# Altium schematic sheet FETs.SchDoc
size A4
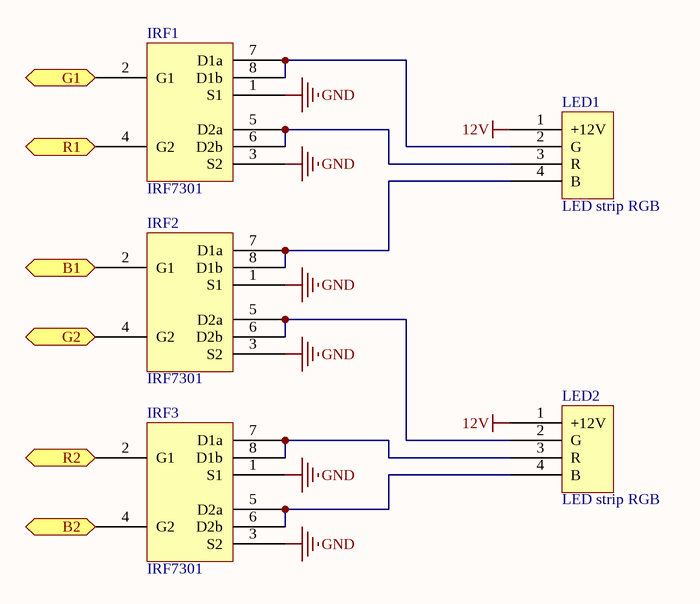
[diagram p0: FETs.SchDoc]

## Parts
IRF1  IRF7301  [SOIC-8]
IRF2  IRF7301  [SOIC-8]
IRF3  IRF7301  [SOIC-8]
LED1  LED strip RGB  [LED strip RGB connector]
LED2  LED strip RGB  [LED strip RGB connector]

## Ports
B1 (in), B2 (in), G1 (in), G2 (in), R1 (in), R2 (in)

## Nets
12V: LED1.1(+12V) LED2.1(+12V)
GND: IRF1.1(S1) IRF1.3(S2) IRF2.1(S1) IRF2.3(S2) IRF3.1(S1) IRF3.3(S2)
B1: IRF2.2(G1) ; port B1
B2: IRF3.4(G2) ; port B2
G1: IRF1.2(G1) ; port G1
G2: IRF2.4(G2) ; port G2
R1: IRF1.4(G2) ; port R1
R2: IRF3.2(G1) ; port R2
NetIRF1_5: IRF1.5(D2a) IRF1.6(D2b) LED1.3(R)
NetIRF1_7: IRF1.7(D1a) IRF1.8(D1b) LED1.2(G)
NetIRF2_5: IRF2.5(D2a) IRF2.6(D2b) LED2.2(G)
NetIRF2_7: IRF2.7(D1a) IRF2.8(D1b) LED1.4(B)
NetIRF3_5: IRF3.5(D2a) IRF3.6(D2b) LED2.4(B)
NetIRF3_7: IRF3.7(D1a) IRF3.8(D1b) LED2.3(R)